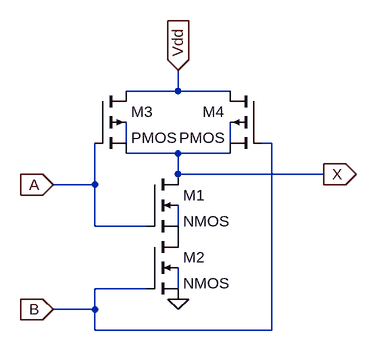
[diagram p0: schematic nand_gate.asc]
nand_gate.asc, the LTspice schematic file:
Version 4.1
SHEET 1 880 680
WIRE 192 -48 192 -80
WIRE 192 -48 112 -48
WIRE 272 -48 192 -48
WIRE 112 32 112 0
WIRE 272 32 272 0
WIRE 336 32 320 32
WIRE 192 48 112 48
WIRE 272 48 192 48
WIRE 192 80 192 48
WIRE 416 80 192 80
WIRE 64 96 64 32
WIRE 64 96 0 96
WIRE 64 160 64 96
WIRE 144 160 64 160
WIRE 192 160 192 128
WIRE 144 256 64 256
WIRE 192 256 192 224
WIRE 64 288 64 256
WIRE 64 288 0 288
WIRE 64 320 64 288
WIRE 336 320 336 32
WIRE 336 320 64 320
FLAG 192 272 0
FLAG 192 -80 Vdd
IOPIN 192 -80 In
FLAG 0 96 A
IOPIN 0 96 In
FLAG 0 288 B
IOPIN 0 288 In
FLAG 416 80 X
IOPIN 416 80 Out
SYMBOL nmos4 144 80 R0
SYMATTR InstName M1
SYMBOL nmos4 144 176 R0
SYMATTR InstName M2
SYMBOL pmos4 64 -48 R0
SYMATTR InstName M3
SYMBOL pmos4 320 -48 M0
SYMATTR InstName M4

The netlist it stands for:
* nand_gate.asc
M1 X A P001 N003 NMOS
M2 P001 B 0 N004 NMOS
M3 Vdd A X N001 PMOS
M4 Vdd B X N002 PMOS
.model NMOS NMOS
.model PMOS PMOS
.lib standard.mos
.backanno
.end